# Altium schematic sheet topLevel.SchDoc: Top Level Schematic
size A4; Revision: AA; SheetNumber: 1; SheetTotal: 4; ImagePath: "D:\git\altium-senior-project\gvsu_logo.jpg"
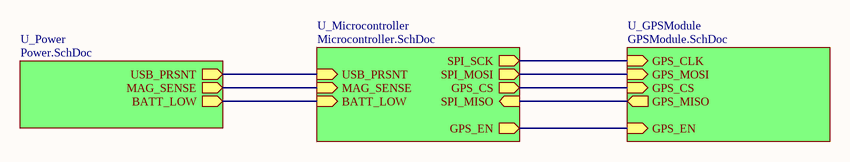
[diagram p0: topLevel.SchDoc]

## Sub-sheets
U_GPSModule = GPSModule.SchDoc: GPS_CLK (in), GPS_MISO (out), GPS_MOSI (in), GPS_CS (in), GPS_EN (in)
U_Microcontroller = Microcontroller.SchDoc: SPI_SCK (out), SPI_MISO (in), SPI_MOSI (out), GPS_CS (out), GPS_EN (out), USB_PRSNT (in), MAG_SENSE (in), BATT_LOW (in)
U_Power = Power.SchDoc: USB_PRSNT (out), MAG_SENSE (out), BATT_LOW (out)

## Nets
(unnamed): sheet U_Microcontroller/SPI_SCK, sheet U_GPSModule/GPS_CLK
(unnamed): sheet U_Microcontroller/SPI_MISO, sheet U_GPSModule/GPS_MISO
(unnamed): sheet U_Microcontroller/SPI_MOSI, sheet U_GPSModule/GPS_MOSI
(unnamed): sheet U_Microcontroller/GPS_CS, sheet U_GPSModule/GPS_CS
(unnamed): sheet U_Microcontroller/GPS_EN, sheet U_GPSModule/GPS_EN
(unnamed): sheet U_Microcontroller/USB_PRSNT, sheet U_Power/USB_PRSNT
(unnamed): sheet U_Microcontroller/MAG_SENSE, sheet U_Power/MAG_SENSE
(unnamed): sheet U_Microcontroller/BATT_LOW, sheet U_Power/BATT_LOW

## Notes on the sheet
- Title
- Size:
- Date:
- A4
- Number:
- Time:
- Revision:
- Sheet
- of
- Grand Valley State University
- 301 W Fulton St
- Grand Rapids, MI
- 49504
- File: